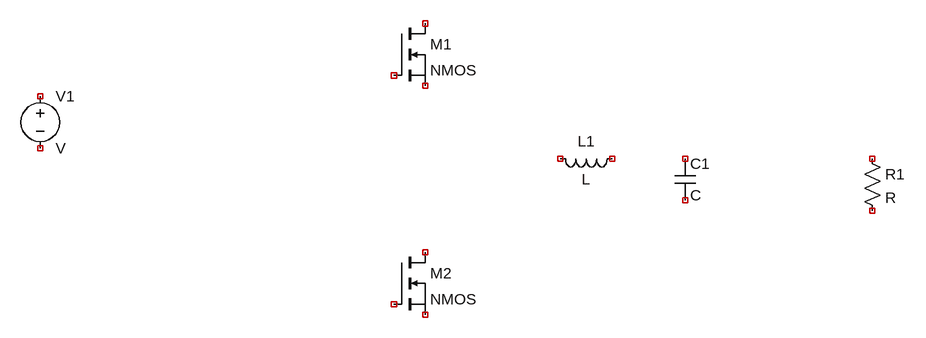
[diagram p0: schematic Buck_Converter_1st_Draft.asc]
Buck_Converter_1st_Draft.asc, the LTspice schematic file:
Version 4
SHEET 1 888 680
SYMBOL nmos 96 192 R0
SYMATTR InstName M1
SYMBOL nmos 96 544 R0
SYMATTR InstName M2
SYMBOL ind 448 384 R90
WINDOW 0 5 56 VBottom 2
WINDOW 3 32 56 VTop 2
SYMATTR InstName L1
SYMBOL cap 528 400 R0
SYMATTR InstName C1
SYMBOL res 816 384 R0
SYMATTR InstName R1
SYMBOL voltage -448 288 R0
SYMATTR InstName V1

The netlist it stands for:
* Buck_Converter_1st_Draft.asc
M1 NC_01 NC_02 NC_03 NC_03 NMOS
M2 NC_04 NC_05 NC_06 NC_06 NMOS
L1 NC_07 NC_08 L
C1 NC_09 NC_10 C
R1 NC_11 NC_12 R
V1 NC_13 NC_14 V
.model NMOS NMOS
.model PMOS PMOS
.lib standard.mos
.backanno
.end